# Altium schematic sheet MCU.SchDoc
size A3
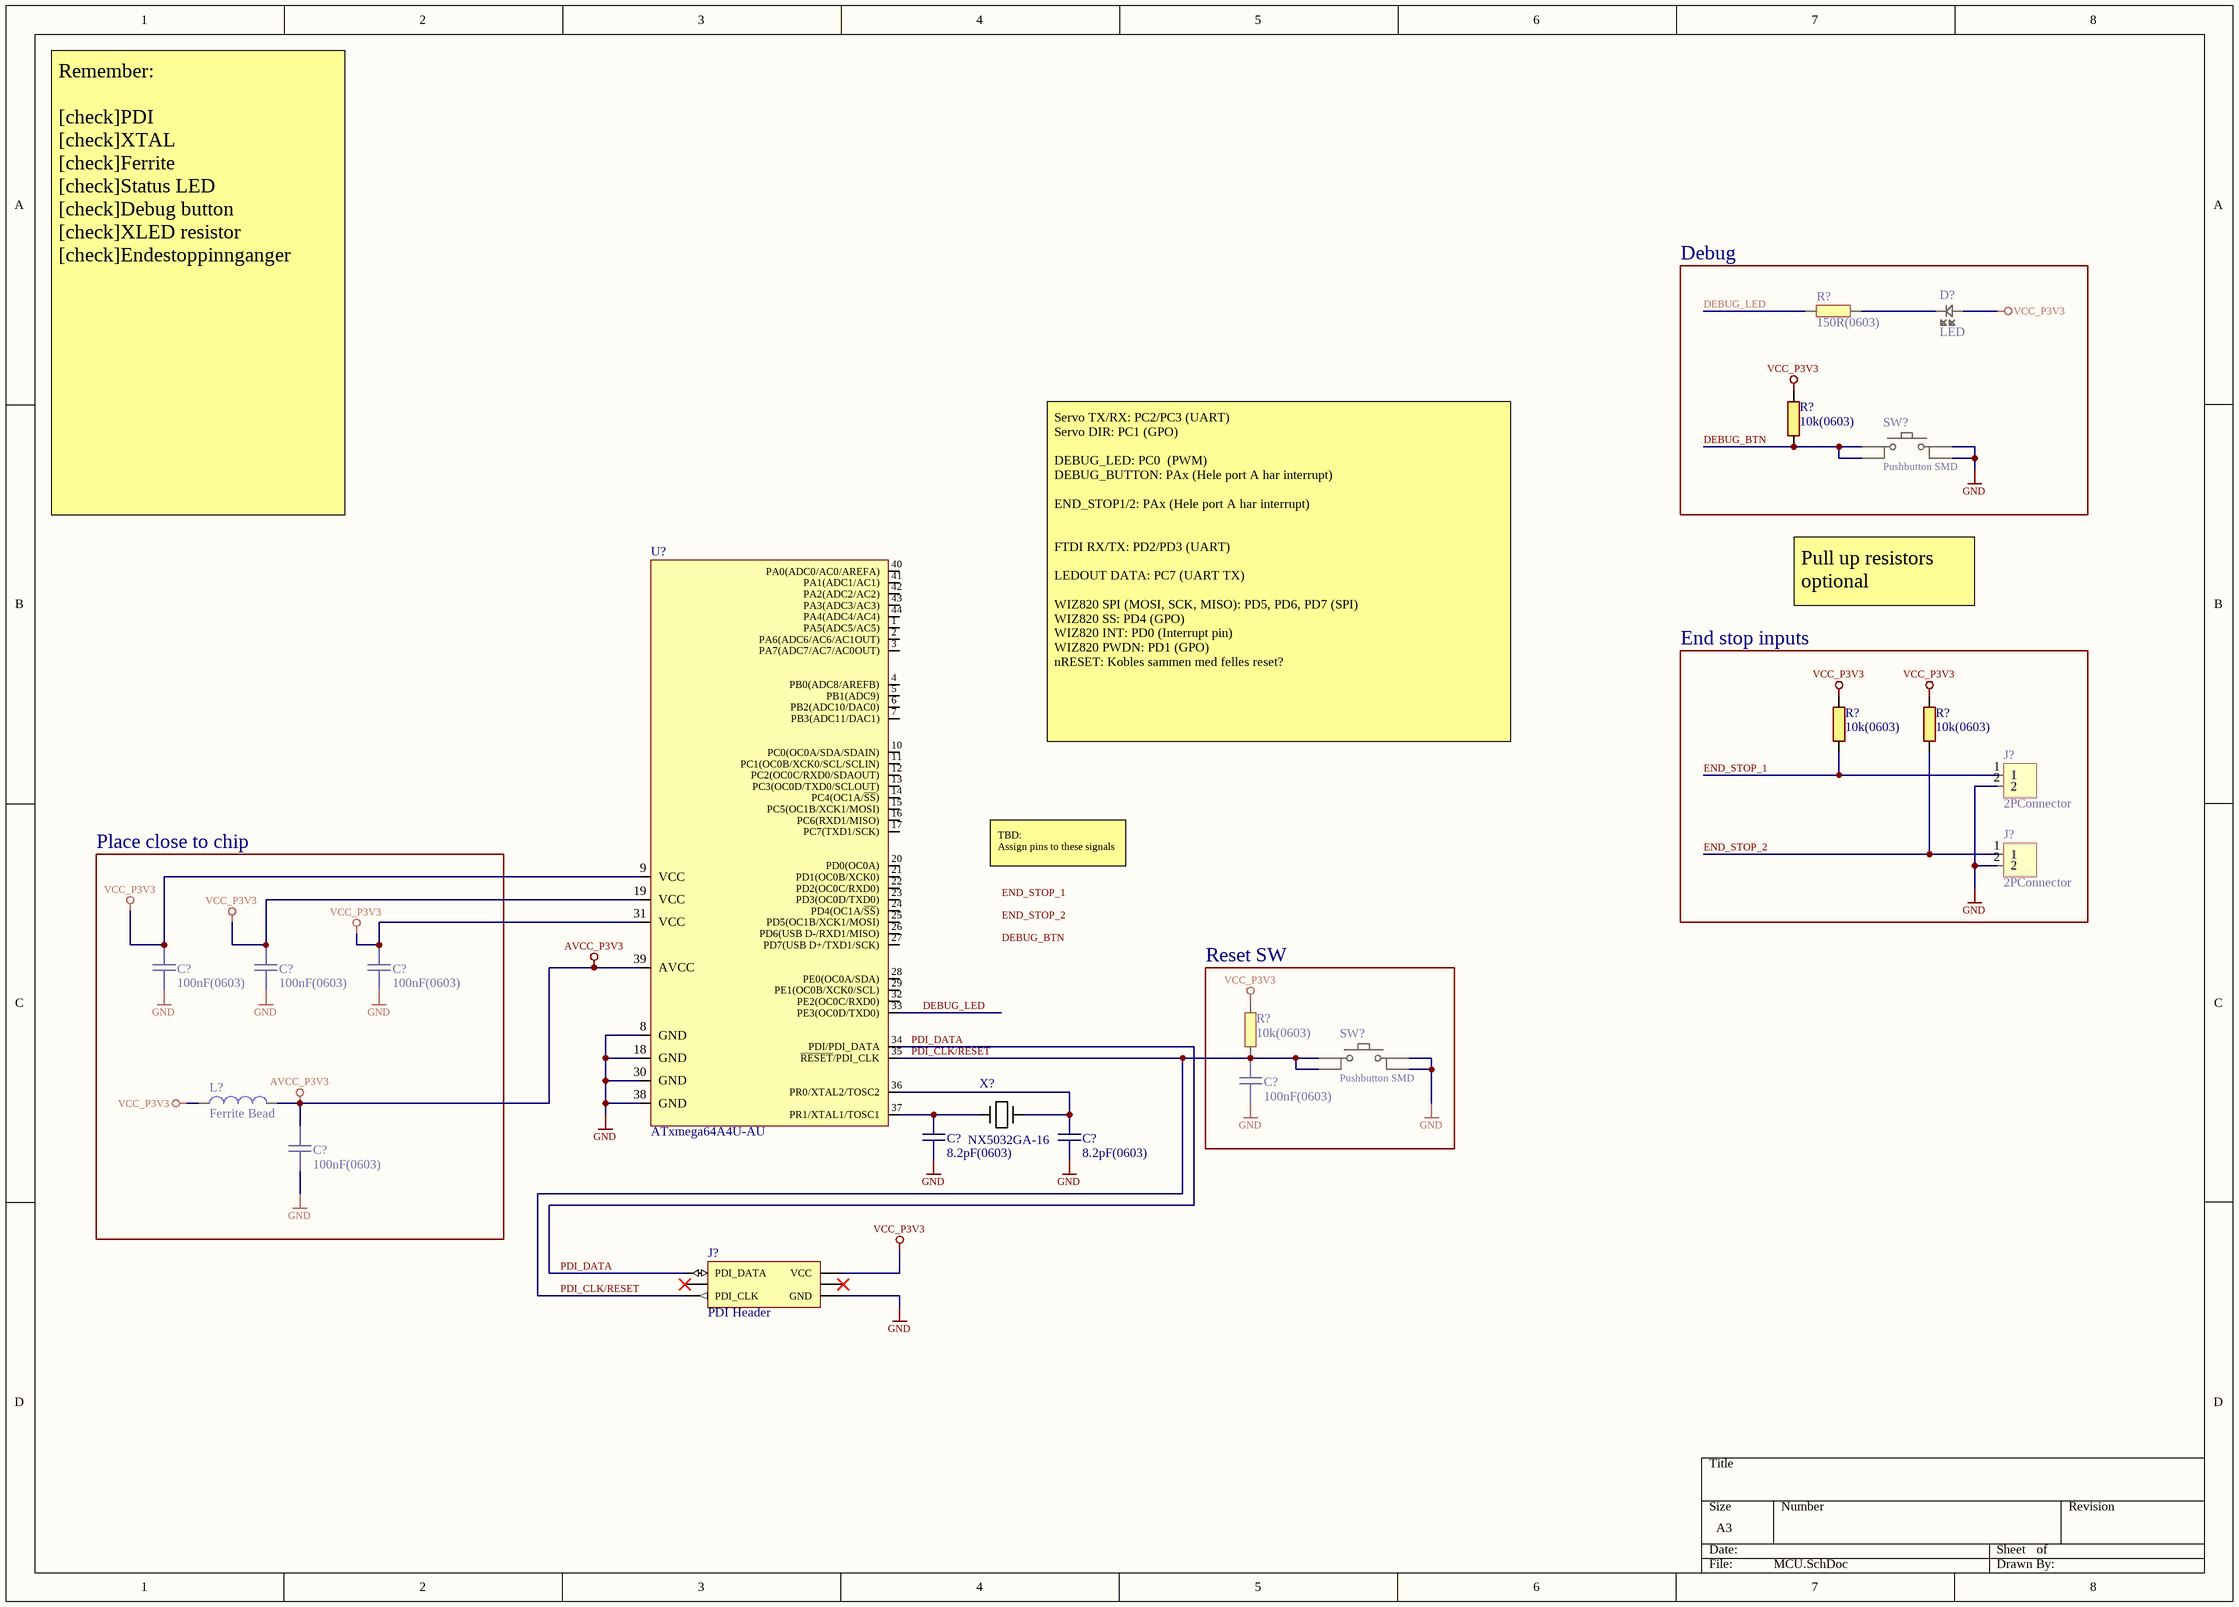
[diagram p0: MCU.SchDoc]

## Parts
(Parts that share a designator on the sheet are numbered #1, #2 ... from top to bottom, then left to right.)
C?#1  100nF(0603)  [CAPC0603(1608)55_N]
C?#2  100nF(0603)  [CAPC0603(1608)55_N]
C?#3  100nF(0603)  [CAPC0603(1608)55_N]
C?#4  100nF(0603)  [CAPC0603(1608)55_N]
C?#5  8.2pF(0603)  [CAPC0603(1608)55_N]
C?#6  8.2pF(0603)  [CAPC0603(1608)55_N]
C?#7  100nF(0603)  [CAPC0603(1608)55_N]
D?  LED  [I_LEDC0603(1608)_N]
J?#1  2PConnector  [JST_2P]
J?#2  2PConnector  [JST_2P]
J?#3  PDI Header  [HEADER_3x2]
L?  Ferrite Bead  [0603]
R?#1  150R(0603)  [RESC0603(1608)_N]
R?#2  10k(0603)  [RESC0603(1608)_N]
R?#3  10k(0603)  [RESC0603(1608)_N]
R?#4  10k(0603)  [RESC0603(1608)_N]
R?#5  10k(0603)  [RESC0603(1608)_N]
SW?#1  Pushbutton SMD  [SOIC254P500X160-4]
SW?#2  Pushbutton SMD  [SOIC254P500X160-4]
U?  ATxmega64A4U-AU  [44A_N]
X?  NX5032GA-16  [CRYSTAL-ABM7]

## Blocks framed on the sheet
Debug: D? R?#1 R?#2 SW?#1
End stop inputs: J?#1 J?#2 R?#3 R?#4
Place close to chip: C?#1-C?#3 C?#7 L?
Reset SW: C?#4 R?#5 SW?#2

## Nets
AVCC_P3V3: C?#7.2 L?.2 U?.39(AVCC)
GND: C?#1.2 C?#2.2 C?#3.2 C?#4.1 C?#5.1 C?#6.1 C?#7.1 J?#1.2 J?#2.2 J?#3.6(GND) SW?#1.3 SW?#1.4 SW?#2.3 SW?#2.4 U?.8(GND) U?.18(GND) U?.30(GND) U?.38(GND)
VCC_P3V3: C?#1.1 C?#2.1 C?#3.1 D?.1 J?#3.2(VCC) L?.1 R?#2.2 R?#3.2 R?#4.2 R?#5.2 U?.9(VCC) U?.19(VCC) U?.31(VCC)
DEBUG_BTN: R?#2.1 SW?#1.1 SW?#1.2
DEBUG_LED: R?#1.1 U?.33(PE3(OC0D/TXD0))
END_STOP_1: J?#1.1 R?#3.1
END_STOP_2: J?#2.1 R?#4.1
PDI_CLK/RESET: C?#4.2 J?#3.5(PDI_CLK) R?#5.1 SW?#2.1 SW?#2.2 U?.35(~{RESET}/PDI_CLK)
PDI_DATA: J?#3.1(PDI_DATA) U?.34(PDI/PDI_DATA)
NetC?#5_2: C?#5.2 U?.37(PR1/XTAL1/TOSC1) X?.1
NetC?#6_2: C?#6.2 U?.36(PR0/XTAL2/TOSC2) X?.2
NetD?_2: D?.2 R?#1.2

Not connected (* = marked no-connect by the designer): J?#3 3* 4*; U? 1(PA5(ADC5/AC5)) 2(PA6(ADC6/AC6/AC1OUT)) 3(PA7(ADC7/AC7/AC0OUT)) 4(PB0(ADC8/AREFB)) 5(PB1(ADC9)) 6(PB2(ADC10/DAC0)) 7(PB3(ADC11/DAC1)) 10(PC0(OC0A/SDA/SDAIN)) 11(PC1(OC0B/XCK0/SCL/SCLIN)) 12(PC2(OC0C/RXD0/SDAOUT)) 13(PC3(OC0D/TXD0/SCLOUT)) 14(PC4(OC1A/~{SS})) 15(PC5(OC1B/XCK1/MOSI)) 16(PC6(RXD1/MISO)) 17(PC7(TXD1/SCK)) 20(PD0(OC0A)) 21(PD1(OC0B/XCK0)) 22(PD2(OC0C/RXD0)) 23(PD3(OC0D/TXD0)) 24(PD4(OC1A/~{SS})) 25(PD5(OC1B/XCK1/MOSI)) 26(PD6(USB_D-/RXD1/MISO)) 27(PD7(USB_D+/TXD1/SCK)) 28(PE0(OC0A/SDA)) 29(PE1(OC0B/XCK0/SCL)) 32(PE2(OC0C/RXD0)) 40(PA0(ADC0/AC0/AREFA)) 41(PA1(ADC1/AC1)) 42(PA2(ADC2/AC2)) 43(PA3(ADC3/AC3)) 44(PA4(ADC4/AC4))

## Notes on the sheet
- Remember:
  [check]PDI
  [check]XTAL
  [check]Ferrite
  [check]Status LED
  [check]Debug button
  [check]XLED resistor
  [check]Endestoppinnganger
- Pull up resistors optional
- Servo TX/RX: PC2/PC3 (UART)
  Servo DIR: PC1 (GPO)
  DEBUG_LED: PC0 	(PWM)
  DEBUG_BUTTON: PAx (Hele port A har interrupt)
  END_STOP1/2: PAx (Hele port A har interrupt)
  FTDI RX/TX: PD2/PD3 (UART)
  LEDOUT DATA: PC7 (UART TX)
  WIZ820 SPI (MOSI, SCK, MISO): PD5, PD6, PD7 (SPI)
  WIZ820 SS: PD4 (GPO)
  WIZ820 INT: PD0 (Interrupt pin)
  WIZ820 PWDN: PD1 (GPO)
  nRESET: Kobles sammen med felles reset?
- TBD:
  Assign pins to these signals
- Labels drawn without touching a wire or pin: DEBUG_BTN, END_STOP_1, END_STOP_2

## Library data of the parts
C?#1-C?#4 C?#7 = 100nF(0603): 100nF 0603 5% X7R 50V; pakke_opprettet_av: 815; pris: 1; nokkelord: Kondensator, Capacitor, CAP; pakketype: 93; id: 3028; navn: 100nF(0603); pakke_opprettet: 18.02.2015 14:18:13; symbol_opprettet_av: 815; symbol_opprettet: 14.11.2014 20:19:34
C?#5 C?#6 = 8.2pF(0603): 0603 5% NP0 50V; pakke_opprettet_av: 815; pris: 1; nokkelord: Kondensator, Capacitor, CAP; pakketype: 93; id: 3032; navn: 8.2pF(0603); pakke_opprettet: 18.02.2015 14:18:13; symbol_opprettet_av: 815; symbol_opprettet: 14.11.2014 20:19:34
D? = SMD LED Red: SMD; rad: 0; rom: OV; lager_type: Fremlager; dybde: 2; hylle: 13; antall: 50; pakke_opprettet_av: 815; leverandor_varenr: 8554641; pris: 1; pakketype: 93; produsent: Avago; leverandor: Farnell; id: 2209; navn: SMD LED Red; kolonne: 0; pakke_opprettet: 06.07.2014 18:55:44; symbol_opprettet_av: 815; symbol_opprettet: 06.07.2014 18:59:47; nokkelord: SMD
J?#1 J?#2 = JST 2pin: pris pr. stk.; pakke_opprettet_av: 815; pris: 2; nokkelord: Connector, Kontakt; pakketype: 92; id: 2227; navn: JST 2pin; pakke_opprettet: 28.06.2014 18:25:03; symbol_opprettet_av: 815; symbol_opprettet: 28.06.2014 15:33:17
J?#3 = PDI-HEADER: PDI Xmega programming header; pakke_opprettet_av: 774; leverandor_varenr: Derp; pris: 3; pakketype: 92; produsent: OV; leverandor: Farnell; id: 2407; navn: PDI-HEADER; pakke_opprettet: 23.08.2014 13:37:50; symbol_opprettet_av: 774; symbol_opprettet: 23.08.2014 13:38:30; nokkelord: PDI Xmega programming
L? = BLM18SG331TN1D: Ferrite Bead 0603; Farnell: 1515756RL; MPN: BLM18SG331TN1D; Digi-Key: 490-3997-1-ND
R?#1 = 3031: 0603 0.1W 1% Thick film resistor; id: 3031; pakke_opprettet_av: 815; symbol_opprettet_av: oystesm; pris: 0; nokkelord: Motstand, Resistor; pakketype: 93; produsent: Multikomp; pakke_opprettet: 08.07.2014 21:15:30; symbol_opprettet: 08.07.2014 21:16:33; navn: 150R(0603)
R?#2-R?#5 = 2444: 10k 0603 0.1W 1% Thick film resistor; id: 2444; rad: -1; rom: OV; lager_type: Fremlager; dybde: 72; hylle: 6; antall: 100; kolonne: 0; pakke_opprettet_av: 815; symbol_opprettet_av: oystesm; nokkelord: Resistor Motstand; pakketype: 93; pakke_opprettet: 08.07.2014 21:15:30; symbol_opprettet: 08.07.2014 21:16:33; navn: 10k(0603); pris: 0
SW?#1 SW?#2 = Pushbutton SMD: Momentary tactile pushbutton SMD; rad: 3; rom: OV; lager_type: Fremlager; dybde: 2; hylle: 7; antall: 100; pakke_opprettet_av: 815; nokkelord: smd, tactile, pushbutton, knapp, smd; pakketype: 101; id: 2413; navn: Pushbutton SMD; kolonne: 3; pakke_opprettet: 14.11.2014 22:12:31; symbol_opprettet_av: 815; symbol_opprettet: 14.11.2014 21:57:30; pris: 2
U? = ATxmega64A4U-AU: 8/16-bit AVR XMEGA A4U Microcontroller, 1.6-3.6V, 64KB + 4KB Flash; PackageReference: 44A; PackageDescription: 44-Pin Plastic Thin Profile Quad Flat Pack, 10 x 10 x 1.0 mm Body, 0.8 mm Pitch (TQFP)
X? = NX5032GA-16: Crystal 16 MHz; rad: 0; rom: OV; lager_type: Fremlager; dybde: 1; hylle: 2; antall: 42; kolonne: 3; pakke_opprettet_av: 774; leverandor_varenr: 644-1135-1-ND; pris: 5; nokkelord: xtal, oscillator; pakketype: 101; produsent: NDK; leverandor: DigiKey; id: 1594; navn: NX5032GA-16; pakke_opprettet: 23.08.2014 20:10:40; symbol_opprettet_av: 774; symbol_opprettet: 23.08.2014 20:23:20